# EAGLE design hamilton-3c (EAGLE 8.3.1)
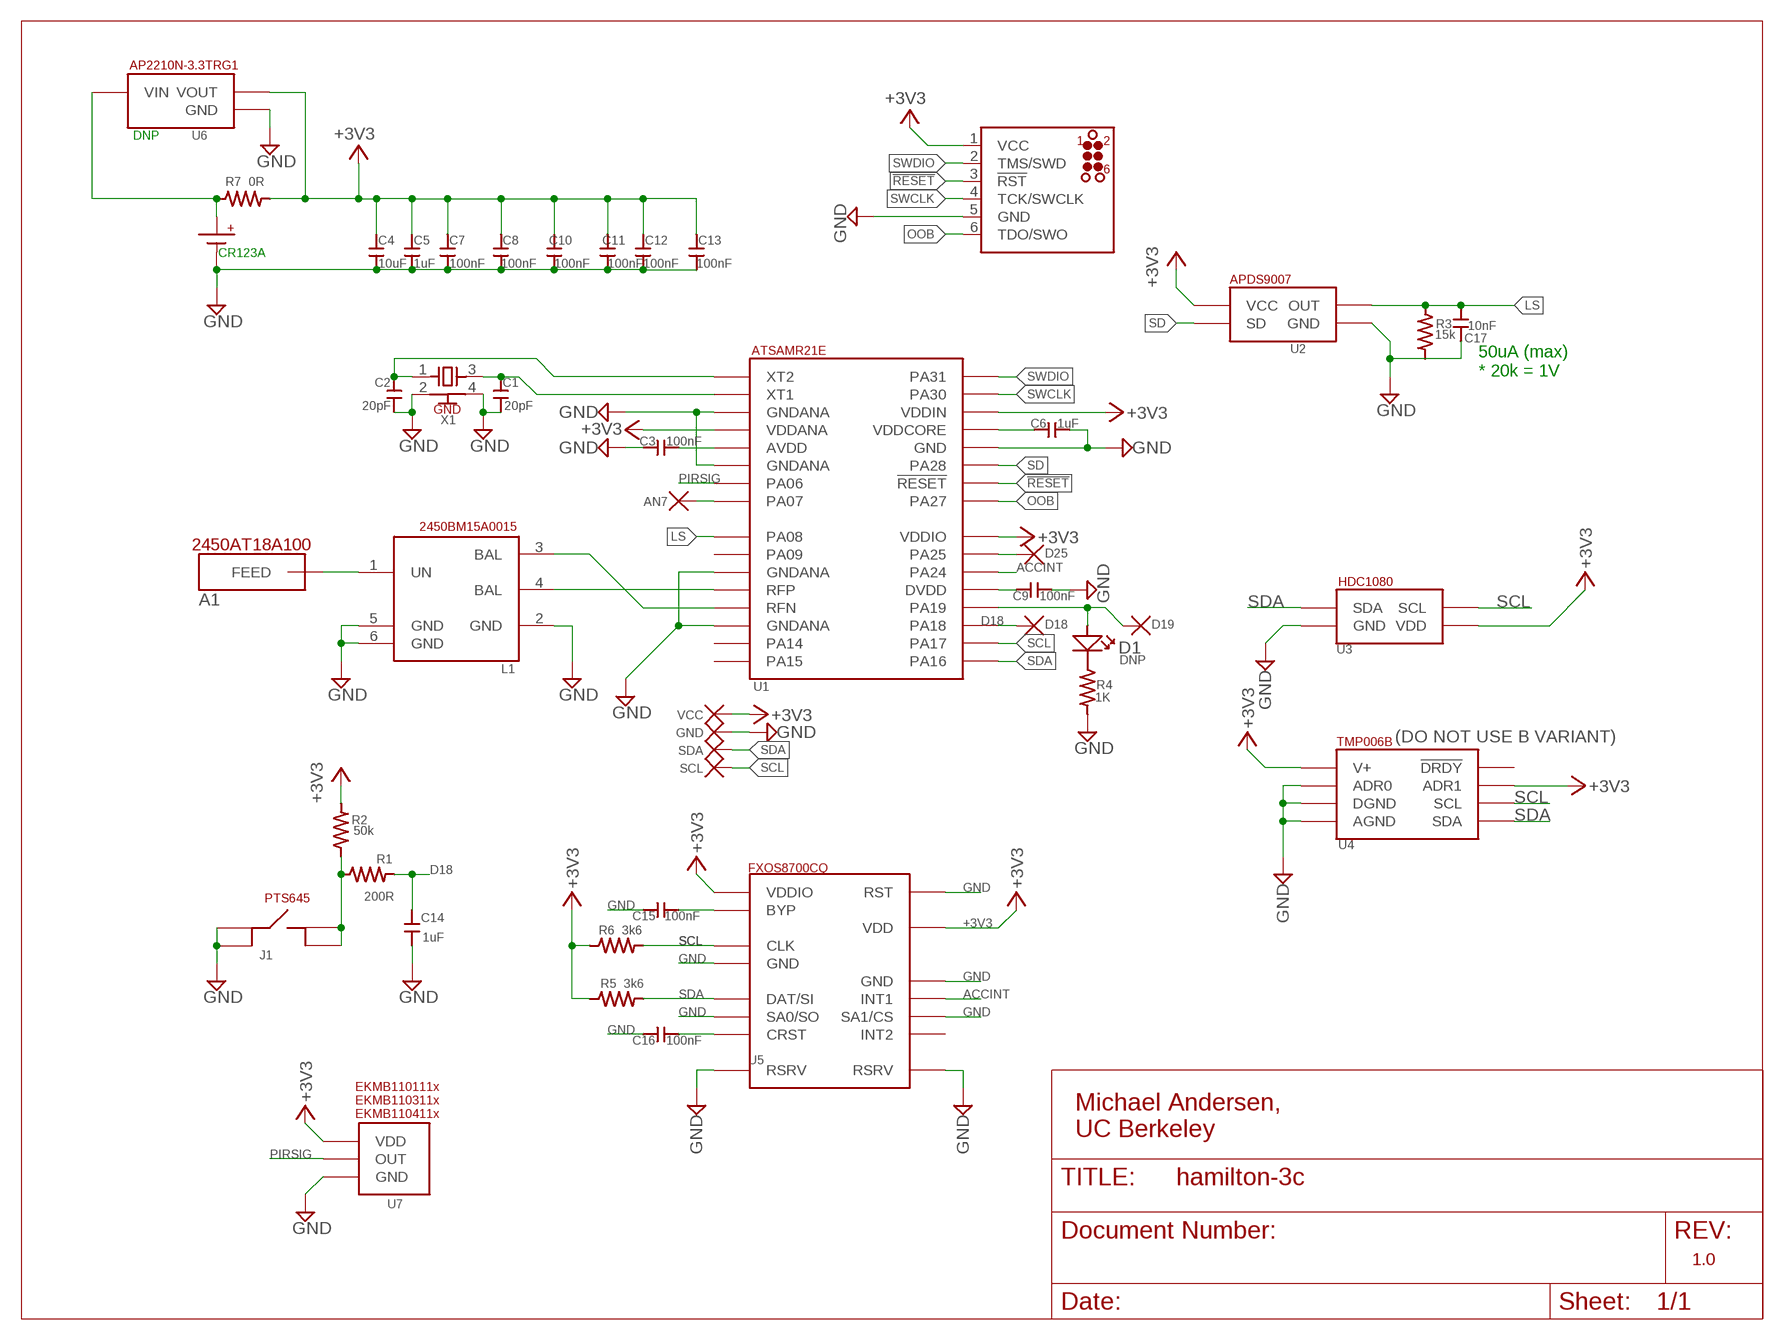
[diagram p0: schematic, sheet 1]

## Parts
A1  JOHANSON_ANTENNA2  [JOHANSON_ANTENNA2]
BT1  2/3A  [2/3A]
C1  20pF  0603_CAPACITORSMALL  [S0402]
C2  20pF  0603_CAPACITORSMALL  [S0402]
C3  100nF  0603_CAPACITORSMALL  [S0402]
C4  10uF  0805_CAPACITOR  [0805]
C5  1uF  0603_CAPACITORSMALL  [S0402]
C6  1uF  0603_CAPACITORSMALL  [S0402]
C7  100nF  0603_CAPACITORSMALL  [S0402]
C8  100nF  0603_CAPACITORSMALL  [S0402]
C9  100nF  0603_CAPACITORSMALL  [S0402]
C10  100nF  0603_CAPACITORSMALL  [S0402]
C11  100nF  0603_CAPACITORSMALL  [S0402]
C12  100nF  0603_CAPACITORSMALL  [S0402]
C13  100nF  0603_CAPACITORSMALL  [S0402]
C14  1uF  0603_CAPACITORSMALL  [S0402]
C15  100nF  0603_CAPACITORSMALL  [S0402]
C16  100nF  0603_CAPACITORSMALL  [S0402]
C17  10nF  0603_CAPACITORSMALL  [S0402]
D1  DNP  STATLEDLINE  [LINE_0603]
J1  PTS645  [PTS645]
L1  BALUN_JOHANSON  [BALUN_JOHANSON]
R1  200R  0603_RESISTORSMALL  [S0402]
R2  50k  0603_RESISTORSMALL  [S0402]
R3  15k  0603_RESISTORSMALL  [S0402]
R4  1K  0603_RESISTORSMALL  [S0402]
R5  3k6  0603_RESISTORSMALL  [S0402]
R6  3k6  0603_RESISTORSMALL  [S0402]
R7  0R  0603_RESISTORSMALL  [S0402]
TP1  D19  TP  [TPP]
TP2  D18  TP  [TPP]
TP3  AN7  TP  [TPP]
TP4  D25  TP  [TPP]
TP5  VCC  TP  [TPP]
TP6  GND  TP  [TPP]
TP7  SDA  TP  [TPP]
TP8  SCL  TP  [TPP]
U1  SAMR21  [QFN32]
U2  APDS9007  [APDS9007]
U3  HDC1080  [WSON_HDC1080]
U4  TMP006B  [TMP006]
U5  ACCEL_FXOS8700CQ  [TQFN16]
U6  SOT23-3VREG  [SOT23]
U7  PANASONIC_PIR  [PIR]
U$1  JLINK_CONNECTWL  [TC2030-MCP]
X1  XTAL  [XTAL]

## Nets
!RESET!: U1.26(!RESET!) U$1.3(!RST!)
+3V3: C4.2 C5.P$2 C7.P$1 C8.P$1 C10.P$1 C11.P$1 C12.P$1 C13.P$1 R2.P$1 R5.P$2 R6.P$2 R7.P$1 TP5.P$1 U1.4(VDDANA) U1.24(VDDIO) U1.30(VDDIN) U2.4(VCC) U3.5(VDD) U4.A3(V+) U4.B1(ADR1) U5.P1(VDDIO) U5.P14(VDD) U6.2(VOUT) U7.VDD U$1.1(VCC)
ACCINT: U1.22(PA24) U5.P11(INT1)
D18: C14.P$2 R1.P$1 TP2.P$1 U1.19(PA18)
GND: BT1.NEG(-) C1.P$1 C2.P$1 C3.P$2 C4.1 C5.P$1 C6.P$1 C7.P$2 C8.P$2 C9.P$1 C10.P$2 C11.P$2 C12.P$2 C13.P$2 C14.P$1 C15.P$2 C16.P$2 C17.P$2 J1.3 J1.4 L1.2(GND) L1.5(GND) L1.6(GND) R3.P$1 R4.P$1 TP6.P$1 U1.3(GNDANA) U1.6(GNDANA) U1.11(GNDANA) U1.14(GNDANA) U1.28(GND) U2.1(GND) U3.2(GND) U4.A1(DGND) U4.A2(AGND) U4.C1(ADR0) U5.P3(RSRV) U5.P5(GND) U5.P7(SA0/SO) U5.P10(SA1/CS) U5.P12(GND) U5.P13(RSRV) U5.P16(RST) U6.1(GND) U7.GND U$1.5(GND) X1.2(GND) X1.4(GND)
LS: C17.P$1 R3.P$2 U1.9(PA08) U2.3(OUT)
N$1: J1.1 J1.2 R1.P$2 R2.P$2
N$2: L1.3(BAL) U1.13(RFN)
N$3: A1.FEED L1.1(UN)
N$4: C2.P$2 U1.1(XT2) X1.1(X1)
N$5: C6.P$2 U1.29(VDDCORE)
N$6: C3.P$1 U1.5(AVDD)
N$7: C1.P$2 U1.2(XT1) X1.3(X2)
N$8: TP3.P$1 U1.8(PA07)
N$9: TP4.P$1 U1.23(PA25)
N$10: C9.P$2 U1.21(DVDD)
N$11: D1.P(+) TP1.P$1 U1.20(PA19)
N$12: BT1.POS(+) R7.P$2 U6.3(VIN)
N$13: L1.4(BAL) U1.12(RFP)
N$14: D1.N(-) R4.P$2
N$16: C15.P$1 U5.P2(BYP)
N$18: C16.P$1 U5.P8(CRST)
OOB: U1.25(PA27) U$1.6(TDO/SWO)
PIRSIG: U1.7(PA06) U7.OUT
SCL: R6.P$1 TP8.P$1 U1.18(PA17) U3.6(SCL) U4.B3(SCL) U5.P4(CLK)
SD: U1.27(PA28) U2.6(SD)
SDA: R5.P$1 TP7.P$1 U1.17(PA16) U3.1(SDA) U4.C3(SDA) U5.P6(DAT/SI)
SWCLK: U1.31(PA30) U$1.4(TCK/SWCLK)
SWDIO: U1.32(PA31) U$1.2(TMS/SWD)
Unconnected: U1.10(PA09) U1.15(PA14) U1.16(PA15) U4.C2(!DRDY!) U5.P9(INT2)

## Notes on the sheet
- DNP
- CR123A
- 50uA (max) 
  * 20k = 1V
- X1
- DNP
- (DO NOT USE B VARIANT)
- Michael Andersen,
  UC Berkeley
- 1.0

## Library data of the parts
A1 = storm:JOHANSON_ANTENNA2
BT1 = storm:2/3A
C1-C3 C5-C17 = storm:0603_CAPACITOR
C4 = storm:0805_CAPACITOR
D1 = storm:STATLED
J1 = storm:PTS645
L1 = storm:BALUN_JOHANSON
R1-R7 = storm:0603_RESISTOR
TP1-TP8 = storm:TP
U1 = storm:SAMR21
U2 = storm:APDS9007
U3 = storm:HDC1080
U4 = storm:TMP006B
U5 = storm:ACCEL_FXOS8700CQ
U6 = storm:SOT23-3VREG
U7 = storm:PANASONIC_PIR
U$1 = storm:JLINK_CONNECT
X1 = storm:XTAL

## Board
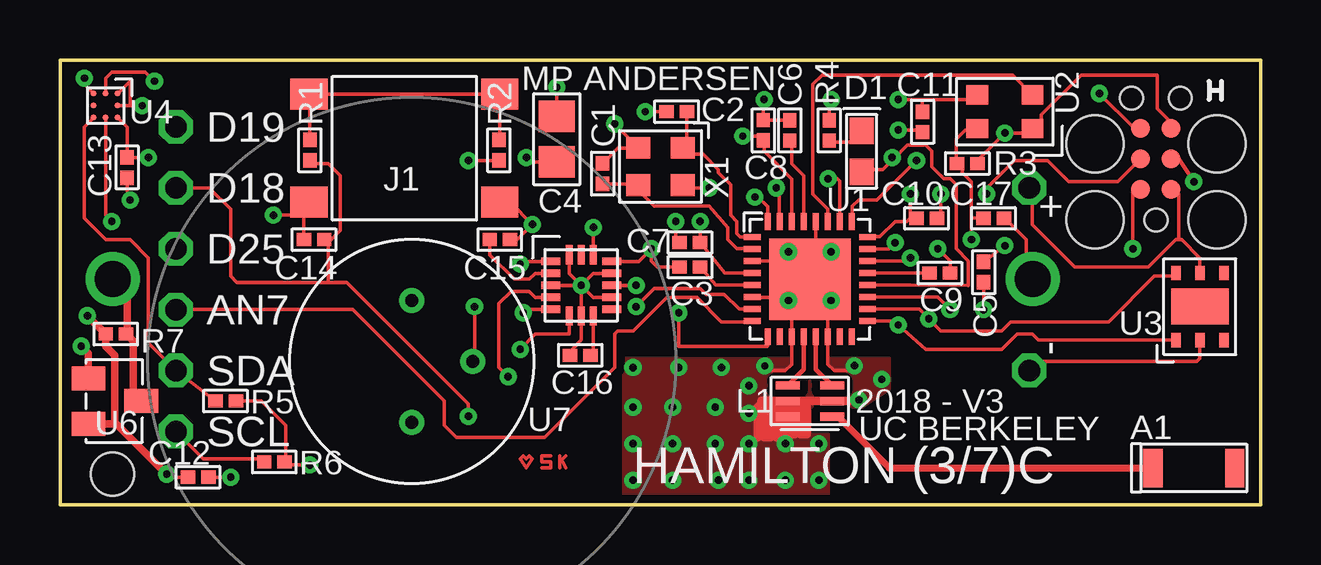
[diagram p1: board, top side]
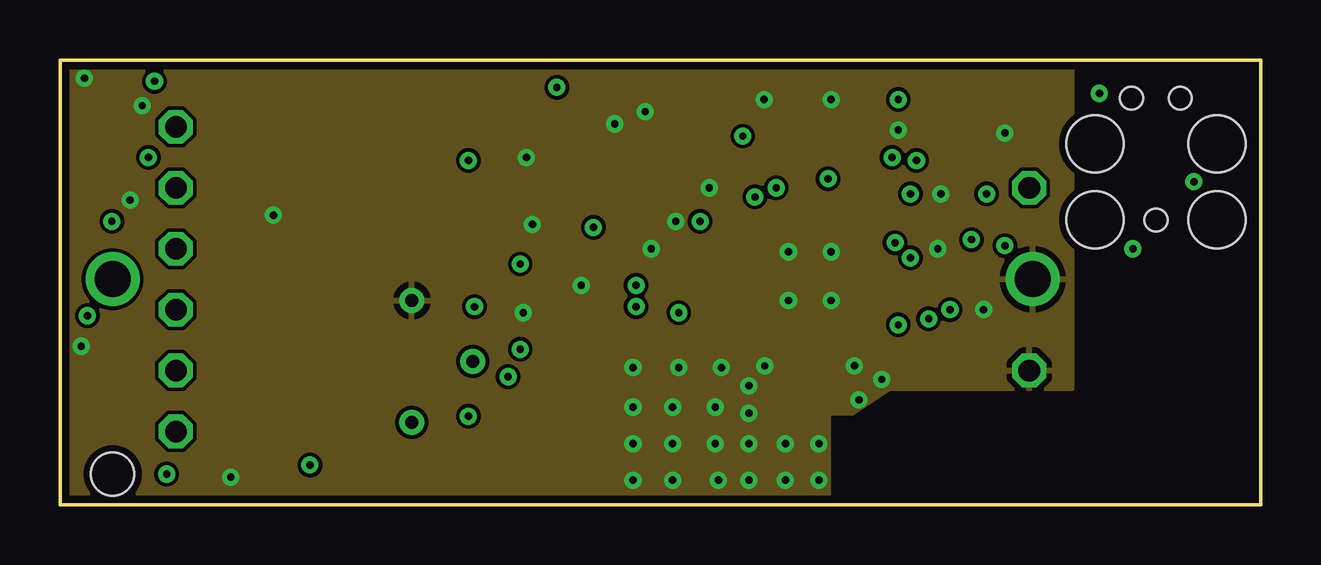
[diagram p2: board, inner layer Route2]
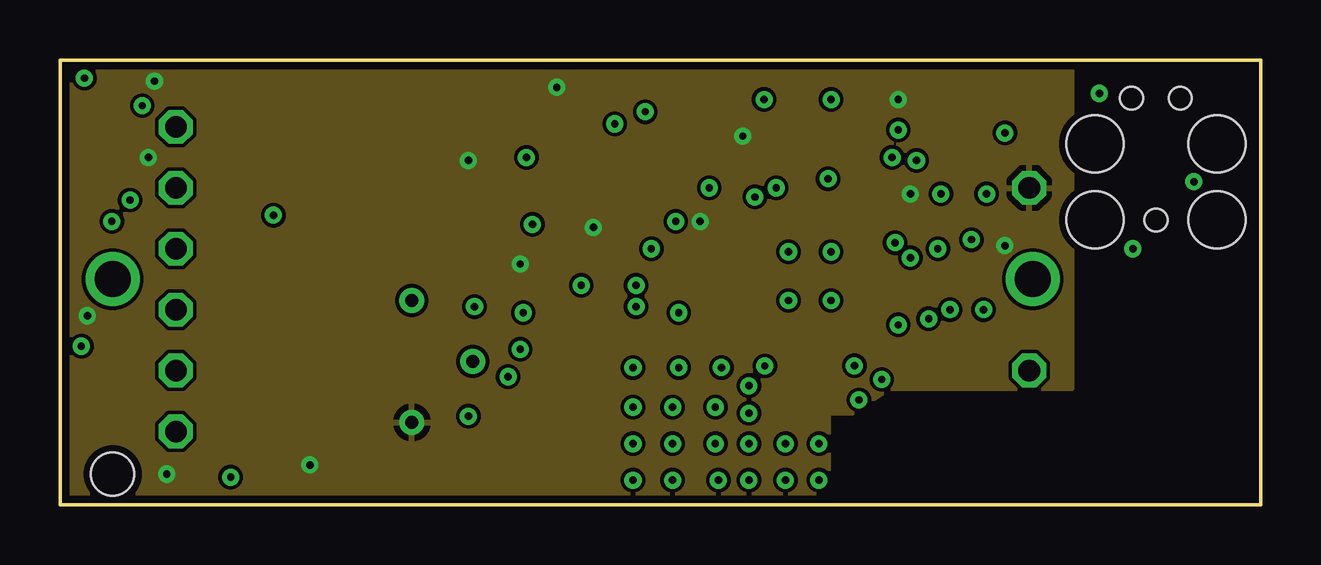
[diagram p3: board, inner layer Route15]
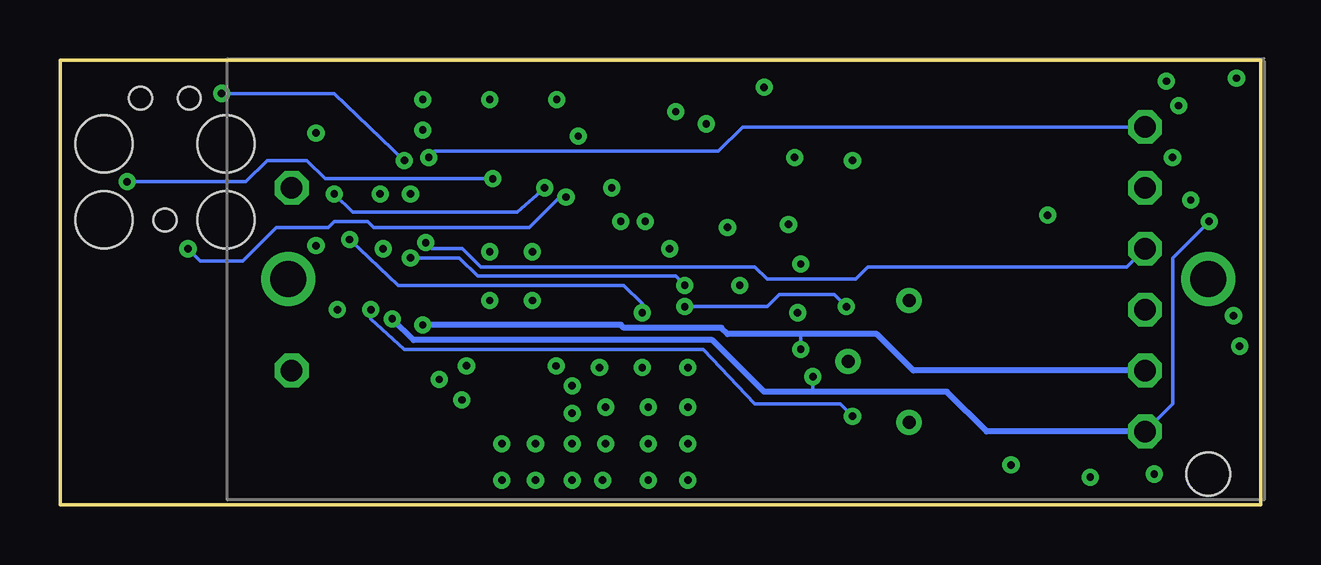
[diagram p4: board, bottom side, seen from below]

Size 50.04 x 18.54 mm. Coordinates in mm from the lower left corner, seen from the top.
Outline: 0,18.54 50.04,18.54 50.04,0 0,0 0,18.54
Copper layers (1*2*15*16): Top 0.035mm / dielectric 1.5mm / Route2 0.035mm / dielectric 0.15mm / Route15 0.035mm / dielectric 0.2mm / Bottom 0.035mm
Design rules "default *": minimum track width 6mil, minimum drill 12mil, track to track 6mil, track to pad 6mil, pad to pad 6mil, via to via 6mil, smd to smd 6mil, copper to edge 12mil, drill to drill 8mil, minimum pad ring 10mil, minimum via ring 8mil, stop-mask expansion 4mil, vias tented up to drill 12mil, thermal gap 10mil

### Footprints (pad centres in the part's own frame; a part is rotated, then mirrored left to right if it is on the bottom)
JOHANSON_ANTENNA2 = smd 0.8 x 1.6: FEED -1.7,0; NC 1.7,0
2/3A = drill 1.5: NEG -19.07,0; POS 19.27,0 | hole 1.8: 19.27,-8.13
S0402 = smd 0.6 x 0.55: P$1 0,0; P$2 0.85,0
0805 = smd 1.3 x 1.5: 1 -0.95,0; 2 0.95,0
LINE_0603 = smd 1.1 x 1: N -0.85,0; P 0.85,0
PTS645 = smd 1.55 x 1.3: 1 -3.975,2.25; 2 3.975,2.25; 3 -3.975,-2.25; 4 3.975,-2.25
BALUN_JOHANSON = smd 1 x 0.35: 1 -0.925,0.65; 2 -0.925,0; 3 -0.925,-0.65; 4 0.925,-0.65; 5 0.925,0; 6 0.925,0.65
TPP = drill 0.9 octagon: P$1 0,0
QFN32 = smd 0.7 x 0.25: 1 -2.4,1.75; 2 -2.4,1.25; 3 -2.4,0.75; 4 -2.4,0.25; 5 -2.4,-0.25; 6 -2.4,-0.75; 7 -2.4,-1.25; 8 -2.4,-1.75; 17 2.4,-1.75; 18 2.4,-1.25; 19 2.4,-0.75; 20 2.4,-0.25; 21 2.4,0.25; 22 2.4,0.75; 23 2.4,1.25; 24 2.4,1.75 | smd 0.25 x 0.7: 9 -1.75,-2.4; 10 -1.25,-2.4; 11 -0.75,-2.4; 12 -0.25,-2.4; 13 0.25,-2.4; 14 0.75,-2.4; 15 1.25,-2.4; 16 1.75,-2.4; 25 1.75,2.4; 26 1.25,2.4; 27 0.75,2.4; 28 0.25,2.4; 29 -0.25,2.4; 30 -0.75,2.4; 31 -1.25,2.4; 32 -1.75,2.4 | smd 3.4 x 3.4: PAD 0,0
APDS9007 = smd 0.9 x 0.8: 1 -1.15,0.7; 3 1.15,0.7; 4 1.15,-0.7; 6 -1.15,-0.7
WSON_HDC1080 = smd 0.6 x 0.4: 1 -1.4,1; 2 -1.4,0; 3 -1.4,-1; 4 1.4,-1; 5 1.4,0; 6 1.4,1 | smd 1.5 x 2.4: P$7 0,0
TMP006 = smd 0.25 x 0.25: A1 -0.5,-0.5; A2 -0.5,0; A3 -0.5,0.5; B1 0,-0.5; B3 0,0.5; C1 0.5,-0.5; C2 0.5,0; C3 0.5,0.5
TQFN16 = smd 0.8 x 0.3: P1 -1.275,1; P2 -1.275,0.5; P3 -1.275,0; P4 -1.275,-0.5; P5 -1.275,-1; P9 1.275,-1; P10 1.275,-0.5; P11 1.275,0; P12 1.275,0.5; P13 1.275,1 | smd 0.3 x 0.8: P6 -0.5,-1.275; P7 0,-1.275; P8 0.5,-1.275; P14 0.5,1.275; P15 0,1.275; P16 -0.5,1.275
SOT23 = smd 1 x 1.4: 1 -0.95,-1.1; 2 0.95,-1.1; 3 0,1.1
PIR = drill 0.55: GND 0,0; OUT 2.54,-2.54; VDD 0,-5.08
TC2030-MCP = smd 0.787 x 0.787: 1 1.27,-0.635; 2 1.27,0.635; 3 2.54,-0.635; 4 2.54,0.635; 5 3.81,-0.635; 6 3.81,0.635 | hole 0.95: 0,0; 5.08,-1.016; 5.08,1.016 | hole 2.375: 0,2.54; 0,-2.54; 3.175,-2.54; 3.175,2.54
XTAL = smd 1 x 0.9: 1 -0.925,-0.775; 2 0.925,-0.775; 3 0.925,0.775; 4 -0.925,0.775

### Placement (x,y rotation side)
A1  47.24,1.52 0 top
BT1  21.46,9.4 0 bottom
C1  22.61,14.22 270 top
C2  25.27,16.38 0 top
C3  26.67,9.91 180 top
C4  20.7,15.24 90 top
C5  38.48,9.27 90 top
C6  30.41,16.03 270 top
C7  26.67,10.92 180 top
C8  29.31,15.18 90 top
C9  37.08,9.65 180 top
C10  35.69,11.94 0 top
C11  35.94,16.38 270 top
C12  5.33,1.14 0 top
C13  2.79,14.48 270 top
C14  10.16,11.05 0 top
C15  17.91,11.05 0 top
C16  22.1,6.22 180 top
C17  38.48,11.94 0 top
D1  33.4,14.73 270 top
J1  14.35,14.86 0 top
L1  31.24,4.32 180 top
R1  10.41,14.35 90 top
R2  18.29,14.35 90 top
R3  38.23,14.22 180 top
R4  32.05,16.03 270 top
R5  6.48,4.32 0 top
R6  8.51,1.78 0 top
R7  1.91,7.11 0 top
TP1  4.83,15.75 0 top
TP2  4.83,13.21 0 top
TP3  4.83,8.13 0 top
TP4  4.83,10.67 0 top
TP5  40.39,13.21 180 top
TP6  40.39,5.59 180 top
TP7  4.83,5.59 0 top
TP8  4.83,3.05 0 top
U1  31.24,9.4 0 top
U2  39.37,16.38 180 top
U3  47.5,8.25 90 top
U4  1.91,16.64 180 top
U5  21.72,9.14 0 top
U6  2.29,4.32 270 top
U7  14.66,8.51 0 top
U$1  45.67,11.87 90 top
X1  25.02,14.1 180 top

### Tracks (layer width: path | path; a pad name or v marks a point on that pad's centre or on a via)
!RESET!  (via drill 0.3)
  Top 0.152: U1.26 32.49,13.48 32.38,13.59 v32,13.59 | v47.24,13.46 46.48,14.61 46.36,14.73 U$1.3
  Bottom 0.152: v32,13.59 38.99,13.59 39.75,14.35 41.4,14.35 42.29,13.46 v47.24,13.46
+3V3  (via drill 0.3)
  Top 0.152: U1.4 27.69,9.65 C7.P$1 v26.67,11.81 | U1.24 33.67,11.18 34.16,11.18 34.8,11.81 35.29,11.81 35.4,11.92 35.42,11.92 C10.P$1 35.43,11.95 v35.43,12.95 | U2.4 38.03,16.89 v34.93,16.89 35.93,16.89 C11.P$1 | 30.48,11.81 U1.30 30.49,13.58 29.34,14.73 29.34,15.15 | C5.P$2 v39.37,10.79 | 29.34,15.15 C8.P$1 | v3.68,14.48 C13.P$1 2.79,15.75 U4.A3 | R2.P$1 v17.02,14.35 | U5.P1 19.07,10.14 v19.18,10.03 | U5.P14 v22.22,11.55 v22.23,11.56 | C4.2 v20.7,17.4 | U3.5 47.5,10.29 46.74,11.05 46.61,11.05 | TP5.P$1 40.51,13.08 40.51,11.68 42.29,9.91 45.34,9.91 46.48,11.05 46.61,11.05 | U$1.1 46.3,13.26 46.61,12.95 46.61,11.05 | 29.34,15.15 29.12,15.15 29.21,15.37 v28.45,15.37 | R5.P$2 8.38,4.32 9.4,3.3 9.4,1.82 R6.P$2 9.4,1.74 9.4,1.65 v10.41,1.65 | C12.P$1 4.57,1.14 v4.45,1.27 | U4.B1 1.91,17.78 2.16,18.03 3.56,18.03 v3.94,17.65
  Top 0.305: v4.45,1.27 2.35,3.37 U6.2 2.23,3.37 2.29,3.43 2.29,6.22 1.91,6.6 R7.P$1 v1.14,7.87
  pour Route15: 0,18.54 42.16,18.67 42.16,4.83 34.54,4.83 33.02,3.81 32,3.81 32,0.25 0,0.25
ACCINT  (via drill 0.3)
  Top 0.152: U1.22 35.29,10.15 v35.43,10.29 | v24,9.14 U5.P11
  Bottom 0.152: v35.43,10.29 33.4,10.29 32.64,9.52 24.38,9.52 v24,9.14
D18  (via drill 0.3)
  Top 0.152: U1.19 36.56,8.65 v37.08,8.13 | v17.02,3.68 17.02,4.19 11.94,9.27 11.18,9.27 | 11.18,9.27 7.37,9.27 7.11,9.52 7.11,12.32 6.22,13.21 TP2.P$1 | C14.P$2 11.18,10.92 | 11.18,10.92 11.68,11.43 11.68,13.72 11.18,14.22 10.54,14.22 R1.P$1 | 11.18,10.92 11.18,9.27
  Bottom 0.152: v37.08,8.13 37.08,7.75 35.69,6.48 23.24,6.48 21.08,4.19 17.53,4.19 v17.02,3.68
GND  (via drill 0.3)
  Top 0.152: 33.15,5.59 32.26,5.59 31.99,5.85 U1.14 31.99,7.99 32,8 | 29.46,5.59 30.23,5.59 30.49,5.85 30.48,7.75 30.61,8 30.49,7.89 U1.11 | C7.P$2 25.64,10.91 25.65,10.79 v25.65,11.81 | X1.4 26.16,13.32 | 26.16,13.32 26.28,13.32 26.29,13.34 | v23.11,15.88 24.09,14.89 X1.2 23.24,14.86 C1.P$1 | C2.P$1 v24.38,16.38 | v27.05,13.21 26.29,13.21 26.16,13.34 26.16,13.32 | U1.6 28.85,8.64 29.97,8.64 30.1,8.51 v30.35,8.51 | U1.3 28.85,10.16 29.72,10.16 29.84,10.29 v30.35,10.54 | U1.28 31.5,10.67 31.88,10.29 v32.13,10.54 | C10.P$2 36.7,11.95 v36.7,12.95 | C5.P$1 v38.48,8.13 | C11.P$2 35.93,15.62 v34.93,15.62 | 40.52,15.49 U2.1 40.71,15.88 40.89,15.88 40.89,16.26 42.55,17.91 45.72,17.91 45.72,16.51 46.17,16.06 U$1.5 | 40.52,15.49 40.52,15.37 | v29.34,16.89 29.31,16.86 C8.P$2 C6.P$1 | R4.P$1 32.05,16.81 v32.13,16.89 | U4.A2 2.92,16.64 | U4.A1 2.92,17.65 2.92,16.64 | v1.02,17.78 1.02,17.53 U4.C1 | C14.P$1 10.16,12.06 | 10.16,12.06 10.16,12.19 9.78,12.19 9.65,12.06 v8.89,12.06 | J1.3 10.38,12.28 10.16,12.06 | U5.P5 19.45,8.14 v19.3,8 | v21.72,9.14 21.22,9.64 U5.P16 | v21.72,9.14 U5.P7 21.72,6.86 21.34,6.48 21.34,6.31 C16.P$2 | U5.P12 22.22,9.64 v21.72,9.14 | U5.P10 22.22,8.64 v21.72,9.14 | C15.P$2 19.05,11.05 v19.69,11.68 18.76,12.61 J1.4 | C4.1 19.62,14.29 v19.43,14.48 | C13.P$2 2.79,13.08 v2.92,12.7 | U3.2 47.5,6.1 47.37,5.97 40.77,5.97 TP6.P$1 | R3.P$1 38.23,14.35 v39.37,15.49 40.52,15.49 | C9.P$1 37.08,10.16 v36.58,10.67 | C3.P$2 24.89,9.91 24.64,10.16 v24.64,10.67 24.11,10.14 U5.P13 | C12.P$2 v7.11,1.14 | 2.92,16.64 v3.43,16.64 | C17.P$2 39.37,11.94 40.26,11.05 40.26,9.67 BT1.NEG | U5.P3 v21.72,9.14
  Top 0.305: U6.1 1.19,6.31 v0.89,6.6
  Top 0.356: 33.4,4.32 L1.5 29.21,4.32 29.21,4.06 | 29.21,4.06 29.34,4.06 | 29.34,4.06 31.12,4.06 31.12,2.92 30.86,2.92 30.86,3.94 30.61,3.94 30.61,2.92 30.48,2.92 30.35,2.79 30.35,3.94 30.1,3.94 30.1,2.79 29.84,2.79 29.84,3.94 29.59,3.94 29.59,2.79 29.34,2.79 29.34,4.06 | 29.21,4.06 29.08,4.06 29.08,2.79
  other vias: 27.56,5.71 25.78,5.71 23.88,5.71 23.88,4.06 25.53,4.06 27.3,4.06 29.37,5.78 28.7,4.95 28.7,3.81 28.7,2.54 30.23,2.54 31.62,2.54 31.62,1.02 30.23,1.02 28.7,1.02 27.43,1.02 25.53,1.02 27.3,2.54 25.53,2.54 23.88,2.54 23.88,1.02 33.1,5.79 34.24,5.22 33.29,4.37 32.13,8.51
  pour Route2: 0,18.54 42.16,18.67 42.16,4.83 34.54,4.83 33.02,3.81 32,3.81 32,0.25 0,0.25
  pour Top (isolate 0.356): 34.54,6.1 23.49,6.1 23.49,0.13 32,0.13 32,2.92 31.24,2.92 31.24,4.06 33.4,4.06 34.54,4.83
LS  (via drill 0.3)
  Top 0.152: U2.3 38.27,15.64 38.12,15.64 38.1,15.62 37.72,15.62 37.34,15.24 37.34,14.26 R3.P$2 37.34,14.18 37.59,13.97 37.59,13.84 37.97,13.46 37.97,11.94 | U1.9 29.49,6.63 29.46,6.6 25.78,6.6 v25.78,8 | v37.97,11.05 37.97,11.94 | C17.P$1 37.97,11.94
  Bottom 0.152: v37.97,11.05 35.94,9.14 26.54,9.14 25.78,8.38 v25.78,8
N$1
  Top 0.152: R1.P$2 10.41,17.07 | 10.41,17.07 J1.1 | 10.41,17.07 10.45,17.11 J1.2 18.33,15.24 R2.P$2
N$2
  Top 0.178: U1.13 31.49,5.64 L1.3
N$3
  Top 0.3: L1.1 32.4,3.67 34.54,1.52 A1.FEED
N$4
  Top 0.152: U1.1 28.35,11.15 28.19,11.3 28.19,11.81 27.94,12.06 27.94,13.34 27.43,13.84 27.43,13.97 26.8,14.61 26.21,14.61 X1.1 26.12,15.05 C2.P$2
N$5
  Top 0.152: U1.29 30.99,13.71 30.48,14.22 30.48,15.1 C6.P$2
N$6
  Top 0.152: U1.5 27.32,9.15 C3.P$1
N$7
  Top 0.152: U1.2 28.82,10.67 28.19,10.67 27.81,11.05 27.81,11.56 27.05,12.45 24.77,12.45 24.09,13.12 X1.3 24.04,13.37 C1.P$2
N$8
  Top 0.152: U1.8 28.81,7.62 27.56,7.62 26.54,8.64 25.27,8.64 23.88,7.24 23.24,7.24 23.11,7.11 23.11,5.71 20.19,2.79 16.51,2.79 16,3.3 16,4.32 12.19,8.13 TP3.P$1
N$9  (via drill 0.3)
  Top 0.152: U1.23 34.52,10.65 v34.8,10.92
  Bottom 0.152: v34.8,10.92 34.54,10.67 33.27,10.67 32.51,9.91 21.08,9.91 20.57,9.4 16.89,9.4 16.38,9.91 5.59,9.91 TP4.P$1
N$10
  Top 0.152: U1.21 C9.P$2
N$11  (via drill 0.3)
  Top 0.152: U1.20 35.43,9.15 37.85,9.14 37.85,10.16 37.34,10.67 37.34,13.34 37.08,13.59 36.83,13.59 36.32,14.1 36.32,14.73 36.07,14.99 35.31,14.99 34.73,14.41 | 34.73,14.41 34.29,13.97 33.49,13.97 D1.P | 34.73,14.41 v34.67,14.48
  Bottom 0.152: TP1.P$1 21.59,15.75 22.61,14.73 34.42,14.73 v34.67,14.48
N$12
  Top 0.305: BT1.POS 2.19,9.36 2.79,8.76 2.79,7.15 R7.P$2 3.05,6.82 3.05,4.57 3.3,4.32 U6.3
N$13
  Top 0.178: U1.12 30.99,5.64 L1.4
N$14
  Top 0.152: D1.N 33.4,15.49 33.02,15.11 32.11,15.11 R4.P$2
N$15
  Top 0.152: 20.45,2.03 20.07,2.03 20.07,1.78 20.45,1.78 20.45,1.52 20.07,1.52
N$16
  Top 0.152: U5.P2 19.8,9.64 19.56,9.4 18.92,9.4 17.91,10.41 C15.P$1
N$17
  Top 0.152: 20.83,2.03 20.83,1.78 | 20.83,1.52 20.83,1.78 | 21.08,2.03 20.83,1.78 | 20.83,1.78 20.96,1.78 21.08,1.52
N$18
  Top 0.152: U5.P8 22.22,6.34 C16.P$1
N$19
  Top 0.152: 19.18,1.9 19.3,2.03 19.43,1.9 19.56,2.03 19.69,1.9 19.43,1.52 19.18,1.9
OOB  (via drill 0.3)
  Top 0.152: v35.69,14.35 34.04,12.7 33.27,12.7 33.02,12.45 33.02,11.81 33.01,11.81 U1.25 | U$1.6 44.77,15.68 v43.31,17.14
  Bottom 0.152: v43.31,17.14 38.61,17.14 v35.69,14.35
PIRSIG  (via drill 0.3)
  Top 0.152: U1.7 28.3,8.15 27.69,8.76 26.92,8.76 26.67,9.02 24.77,9.02 v24,8.25 | v17.27,8.25 17.27,6.04 U7.OUT
  Bottom 0.152: v24,8.25 20.57,8.25 20.07,8.76 17.78,8.76 v17.27,8.25
SCL  (via drill 0.3)
  Top 0.152: U1.18 35.79,8.15 v36.2,7.75 36.7,7.24 39.24,7.24 39.62,7.62 43.69,7.62 45.59,9.52 46.37,9.52 U3.6 | U5.P4 19.8,8.64 19.56,8.89 18.8,8.89 18.29,8.38 18.29,5.71 v18.67,5.33 | U4.B3 1.91,12.06 v2.16,11.81 | R6.P$1 8.38,1.78 8.25,1.9 5.97,1.9 TP8.P$1
  Bottom 0.152: v18.67,5.33 18.67,4.7 | v2.16,11.81 3.68,10.29 3.68,4.19 TP8.P$1
  Bottom 0.254: TP8.P$1 11.43,3.05 13.08,4.7 18.67,4.7 20.7,4.7 22.86,6.86 35.31,6.86 v36.2,7.75
SD
  Top 0.152: U1.27 31.99,12.33 31.37,12.95 31.37,17.53 31.75,17.91 39.7,17.91 U2.6
SDA  (via drill 0.3)
  Top 0.152: U1.17 34.9,7.65 v34.93,7.49 36.07,6.48 39.24,6.48 39.88,7.11 40.51,7.11 40.77,6.86 U3.1 | R5.P$1 TP7.P$1 | TP7.P$1 3.68,6.73 3.68,10.29 2.92,11.05 1.91,11.05 1.02,11.94 1.02,15.75 U4.C3 | TP7.P$1 | U5.P6 21.22,7.12 21.21,7.11 19.81,7.11 v19.18,6.48
  Bottom 0.152: v19.18,6.48 19.18,7.11
  Bottom 0.254: TP7.P$1 14.48,5.59 16,7.11 19.18,7.11 22.23,7.11 22.48,7.37 26.54,7.37 26.67,7.49 v34.93,7.49
SWCLK  (via drill 0.3)
  Top 0.152: v38.61,12.95 38.61,13.21 39.75,14.35 41.15,14.35 42.04,13.46 44.07,13.46 45.02,14.41 U$1.4 | U1.31 29.97,11.82 29.97,13.08 v29.84,13.21
  Bottom 0.152: v38.61,12.95 37.85,12.19 30.99,12.19 v29.84,13.21
SWDIO  (via drill 0.3)
  Top 0.152: U$1.2 45.03,13.41 44.7,13.08 v44.7,10.67 | U1.32 29.49,12.42 29.08,12.83 v28.96,12.83
  Bottom 0.152: v28.96,12.83 29.21,12.83 30.48,11.56 36.96,11.56 37.21,11.81 38.61,11.81 38.86,11.56 41.02,11.56 42.42,10.16 44.2,10.16 v44.7,10.67

### Text on the board
tPlace: MP ANDERSEN | D1 | + | - | 2018 - V3 | UC BERKELEY | HAMILTON (3/7)C
tNames: X1 | U1